# EAGLE schematic +2A Regulation board (EAGLE 6.5.0)
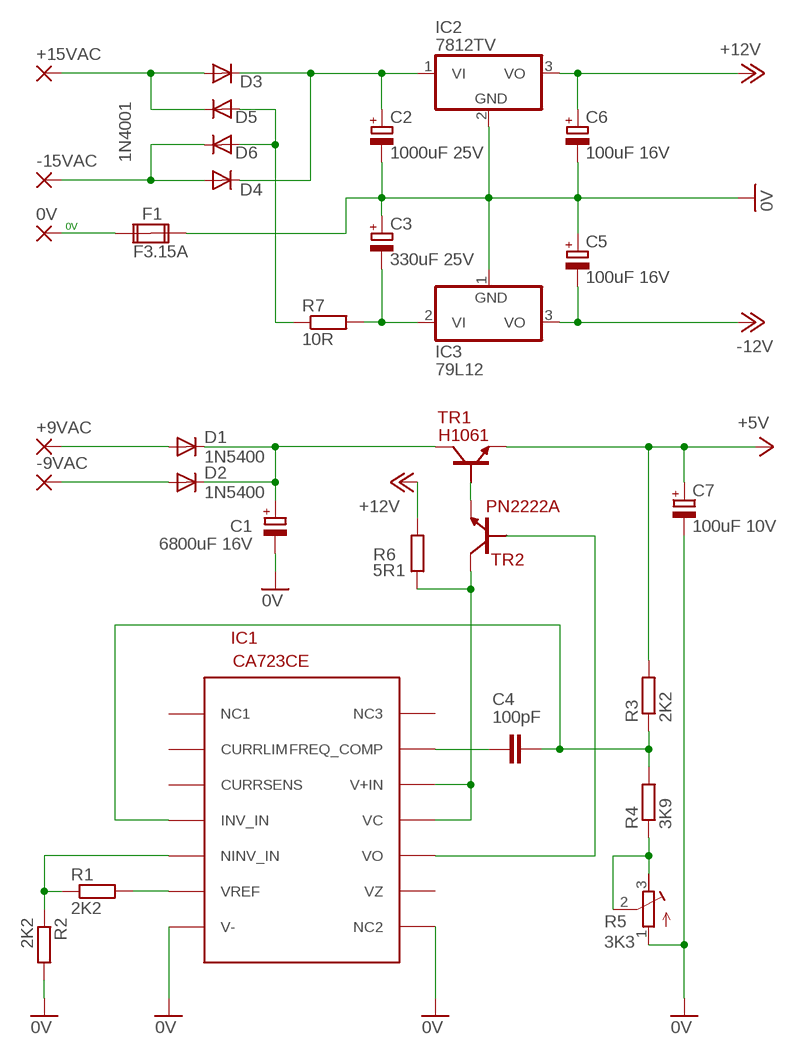
[diagram p0: schematic, sheet 1]

## Parts
0V  3,81/1,4  [3,81/1,4]
+9VAC  3,81/1,4  [3,81/1,4]
+15VAC  3,81/1,4  [3,81/1,4]
-9VAC  3,81/1,4  [3,81/1,4]
-15VAC  3,81/1,4  [3,81/1,4]
C1  6800uF 16V  CPOL-EUE7.5-16  [E7,5-16]
C2  1000uF 25V  CPOL-EUE5-13  [E5-13]
C3  330uF 25V  CPOL-EUE5-10.5  [E5-10,5]
C4  100pF  C-EU025-025X050  [C025-025X050]
C5  100uF 16V  CPOL-EUE2.5-6  [E2,5-6]
C6  100uF 16V  CPOL-EUE2.5-6  [E2,5-6]
C7  100uF 10V  CPOL-EUE2-5  [E2-5]
D1  1N5400  [DO201-15]
D2  1N5400  [DO201-15]
D3  1N4001  1N4004  [DO41-10]
D4  1N4001  1N4004  [DO41-10]
D5  1N4001  1N4004  [DO41-10]
D6  1N4001  1N4004  [DO41-10]
F1  F3.15A  FUSE2P  [FUSE1]
IC1  CA723CE  CA723CA-PDIP  [PDIP-14]
IC2  7812TV  [TO220V]
IC3  79L12  7912L  [TO92]
R1  2K2  R-EU_0207/10  [0207/10]
R2  2K2  R-EU_0207/10  [0207/10]
R3  2K2  R-EU_0207/10  [0207/10]
R4  3K9  R-EU_0207/10  [0207/10]
R5  3K3  R-TRIMM3339P  [RTRIM3339P]
R6  5R1  R-EU_0207/15  [0207/15]
R7  10R  R-EU_0309/10  [0309/10]
TR1  H1061  [TO220AB]
TR2  PN2222A  [TO-92]

## Nets
0V: C1.- C2.- C3.+ C5.+ C6.- C7.- F1.2A IC1.NC2 IC1.V- IC2.2(GND) IC3.1(GND) R2.2 R5.1(E)
+5V: C7.+ R3.2 TR1.E
+12V: C6.+ IC2.3(VO) R6.2
-12V: C5.- IC3.3(VO)
N$1: +15VAC.1(P) D3.A D5.C
N$2: -15VAC.1(P) D4.A D6.C
N$3: D5.A D6.A R7.1
N$4: C2.+ D3.C D4.C IC2.1(VI)
N$5: C1.+ D1.C D2.C TR1.C
N$6: 0V.1(P) F1.1A
N$7: +9VAC.1(P) D1.A
N$8: -9VAC.1(P) D2.A
N$9: R4.1 R5.2(S) R5.3(A)
N$10: TR1.B TR2.E
N$12: C3.- IC3.2(VI) R7.2
N$13: IC1.V+IN IC1.VC R6.1 TR2.C
N$14: IC1.NINV_INP(NINV_IN) R1.1 R2.1
N$16: IC1.VREF R1.2
N$17: C4.1 IC1.FREQ_COMP
N$18: IC1.VO TR2.B
N$19: C4.2 IC1.INV_INP(INV_IN) R3.1 R4.2
Unconnected: F1.1B F1.2B IC1.CURR_LIM(CURRLIM) IC1.CURR_SENS(CURRSENS) IC1.NC1 IC1.NC3 IC1.VZ

## Notes on the sheet
- 0V

## Library data of the parts
0V +9VAC +15VAC -9VAC -15VAC = wirepad:3,81/1,4: THROUGH-HOLE PAD
C1-C3 C5-C7 = rcl:CPOL-EU: POLARIZED CAPACITOR, European symbol
C4 = rcl:C-EU: CAPACITOR, European symbol
D1 D2 = diode:1N5400: DIODE standard rectifier, 3 A, 50 V (Motorola)
D3-D6 = adafruit:1N4004: DIODE General purpose 1N400x type rectifier (With bigger pads) http://www.ladyada.net/library/pcb/eaglelibrary.html
F1 = special:FUSE2P: FUSE 5 x 20 mm
IC1 = Harris-Semi:CA723CA-PDIP
IC2 = linear:78*: Positive VOLTAGE REGULATOR Source: http://cache.national.com/ds/LM/LM78L05.pdf http://www.fairchildsemi.com/ds/LM/LM7805.pdf
IC3 = linear:79*: Negative VOLTAGE REGULATOR
R1-R4 R6 R7 = rcl:R-EU_: RESISTOR, European symbol
R5 = rcl:R-TRIMM: Trimm resistor
TR1 = PMC-Semi:H1061
TR2 = ON-Semi:PN2222A